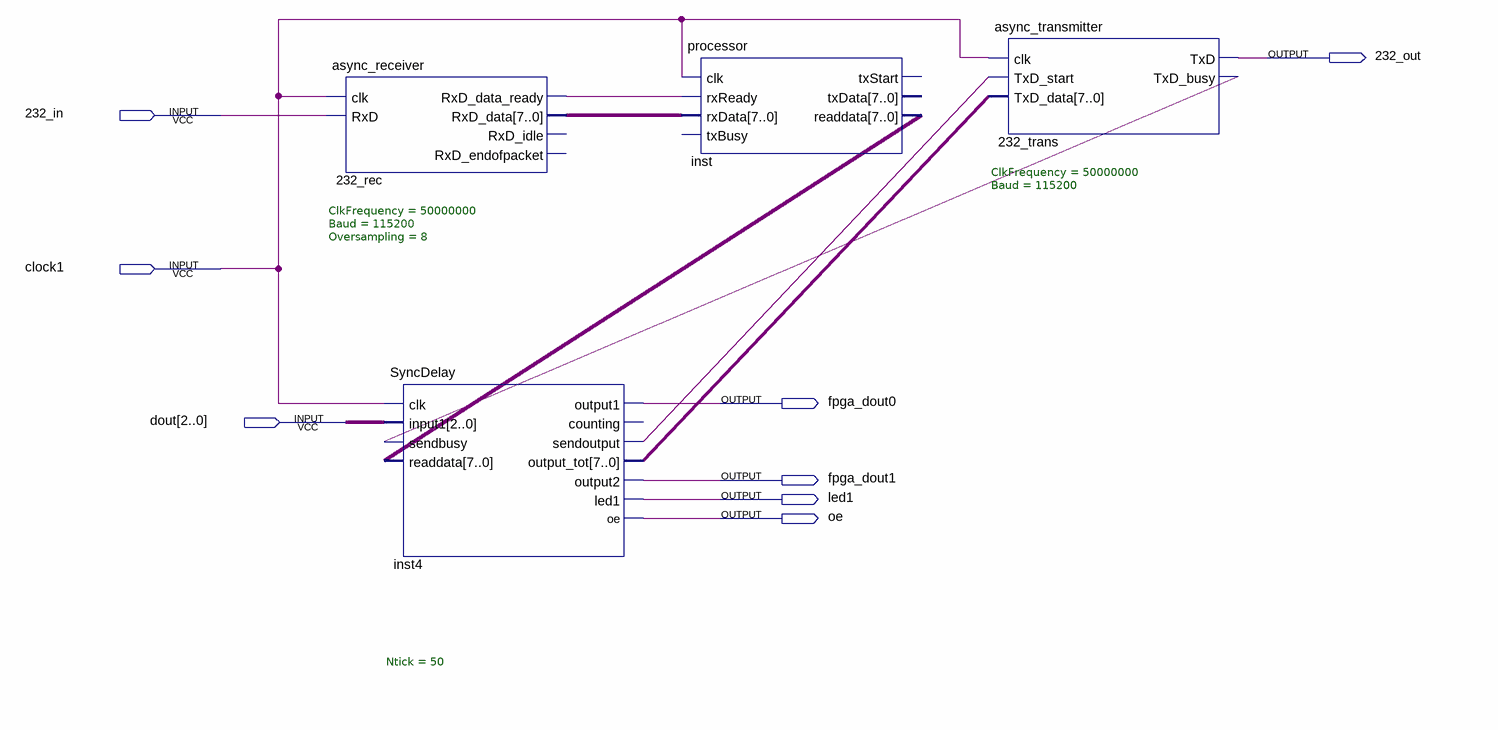
[diagram p0: schematic sheet]
// Quartus schematic serial1.bdf as structural Verilog: 4 symbols, 8 pins
module serial1 (
  input  \232_in ,
  input  clock1,
  input  [2:0] dout,
  output \232_out ,
  output fpga_dout0,
  output fpga_dout1,
  output led1,
  output oe
);

  wire inst4_sendoutput, n232_rec_rxd_data_ready, n232_trans_txd_busy;
  wire [7:0] inst4_output_tot, inst_readdata, n232_rec_rxd_data;

  async_receiver #(.ClkFrequency(50000000), .Baud(115200), .Oversampling(8)) u_232_rec (
    .clk(clock1), .RxD(\232_in ), .RxD_data_ready(n232_rec_rxd_data_ready), .RxD_data(n232_rec_rxd_data));  // open: RxD_idle, RxD_endofpacket
  SyncDelay #(.Ntick(50)) inst4 (
    .clk(clock1), .input1(dout), .sendbusy(n232_trans_txd_busy), .readdata(inst_readdata),
    .output1(fpga_dout0), .sendoutput(inst4_sendoutput), .output_tot(inst4_output_tot), .output2(fpga_dout1),
    .led1(led1), .oe(oe));  // open: counting
  processor inst (
    .clk(clock1), .rxReady(n232_rec_rxd_data_ready), .rxData(n232_rec_rxd_data), .readdata(inst_readdata));  // open: txBusy, txStart, txData
  async_transmitter #(.ClkFrequency(50000000), .Baud(115200)) u_232_trans (
    .clk(clock1), .TxD_start(inst4_sendoutput), .TxD_data(inst4_output_tot), .TxD(\232_out ),
    .TxD_busy(n232_trans_txd_busy));
endmodule
